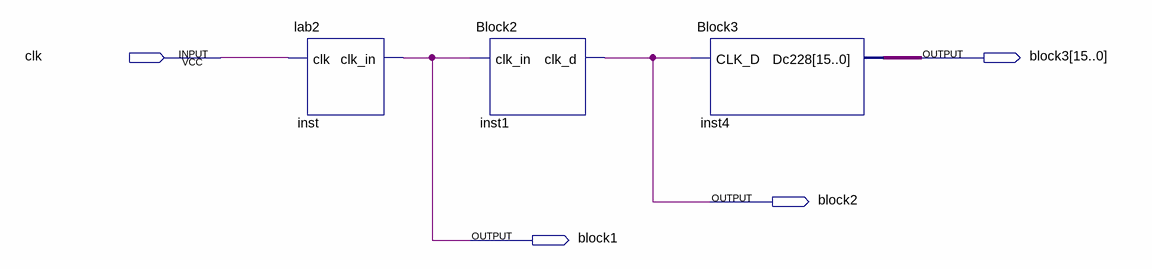
[diagram p0: schematic sheet]
// Quartus schematic AllBlocks.bdf as structural Verilog: 3 symbols, 4 pins
module AllBlocks (
  input  clk,
  output [15:0] block3,
  output block2,
  output block1
);

  lab2 inst (.clk(clk), .clk_in(block1));
  Block2 inst1 (.clk_in(block1), .clk_d(block2));
  Block3 inst4 (.CLK_D(block2), .Dc228(block3));
endmodule
